# Altium schematic sheet ADS1232IPW.schdoc
size 127 x 101 mm
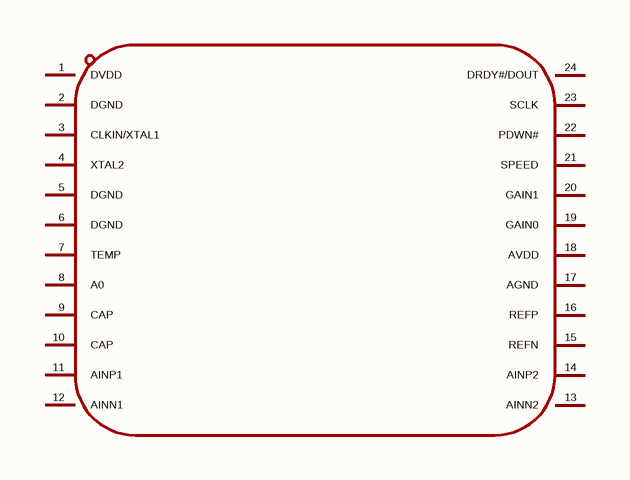
[diagram p0: ADS1232IPW.schdoc]

## Parts
U?  ads1232ipwr  [TSSOP-24_L7.8-W4.4-P0.65-LS6.4-BL]  (value not drawn)

## Nets

Not connected (* = marked no-connect by the designer): U? 1(DVDD) 2(DGND) 3(CLKIN/XTAL1) 4(XTAL2) 5(DGND) 6(DGND) 7(TEMP) 8(A0) 9(CAP) 10(CAP) 11(AINP1) 12(AINN1) 13(AINN2) 14(AINP2) 15(REFN) 16(REFP) 17(AGND) 18(AVDD) 19(GAIN0) 20(GAIN1) 21(SPEED) 22(PDWN#) 23(SCLK) 24(DRDY#/DOUT)

## Library data of the parts
U? = ads1232ipwr: 分辨率(位):24;采样率:10Hz;工作电压:2.7V~5.3V;接口类型:SPI;; Manufacturer: TI(德州仪器); AddInBom: yes; ModelId: 57e278220af748a2882c4abba4094eb9; ModelName: TSSOP-24_L7.8-W4.4-H1.0-LS6.4-P0.65; ModelTransform: 252.188,307.086,0,90,0,0,0,0,0; Resolution (Bits): 24; Sampling Rate: 10Hz; number of channels: 2; Interface: SPI; differential input: 是; Clock/Oscillator: 内置；外置; Clock Frequency: 4.9152MHz；200kHz~8MHz; Voltage Reference: 外置; Programmable Gain: 支持; Temperature Sensors: 内置; ADC architecture: Sigma-Delta; Data rate: 80Hz；10Hz; Quiescent Current (Iq): 1.3uA; Full-Scale Range(FSR): 39mV；1.25V；19.5mV；2.5V; Symbol: ADS1232IPW; LCSC Part Name: 用于桥式传感器的24bit 模数转换器; SupplierPart: C27919; ManufacturerPart: ADS1232IPWR; Supplier Footprint: TSSOP-24; JLCPCB Part Class: Extended Part; Datasheet: https://www.ti.com/cn/lit/gpn/ads1232; Supplier: LCSC; ConvertToPcb: yes; FootprintName: TSSOP-24_L7.8-W4.4-P0.65-LS6.4-BL; Voltage - Supply: 2.7V~5.3V; Integral non - linearity: -; Operating Temperature: -40℃~+105℃; Signal-to-Noise Ratio: -; Voltage Reference Drift: -